# Altium schematic sheet MZ.SchDoc
size Letter; DocumentNumber: 4; SheetNumber: 4; SheetTotal: 8
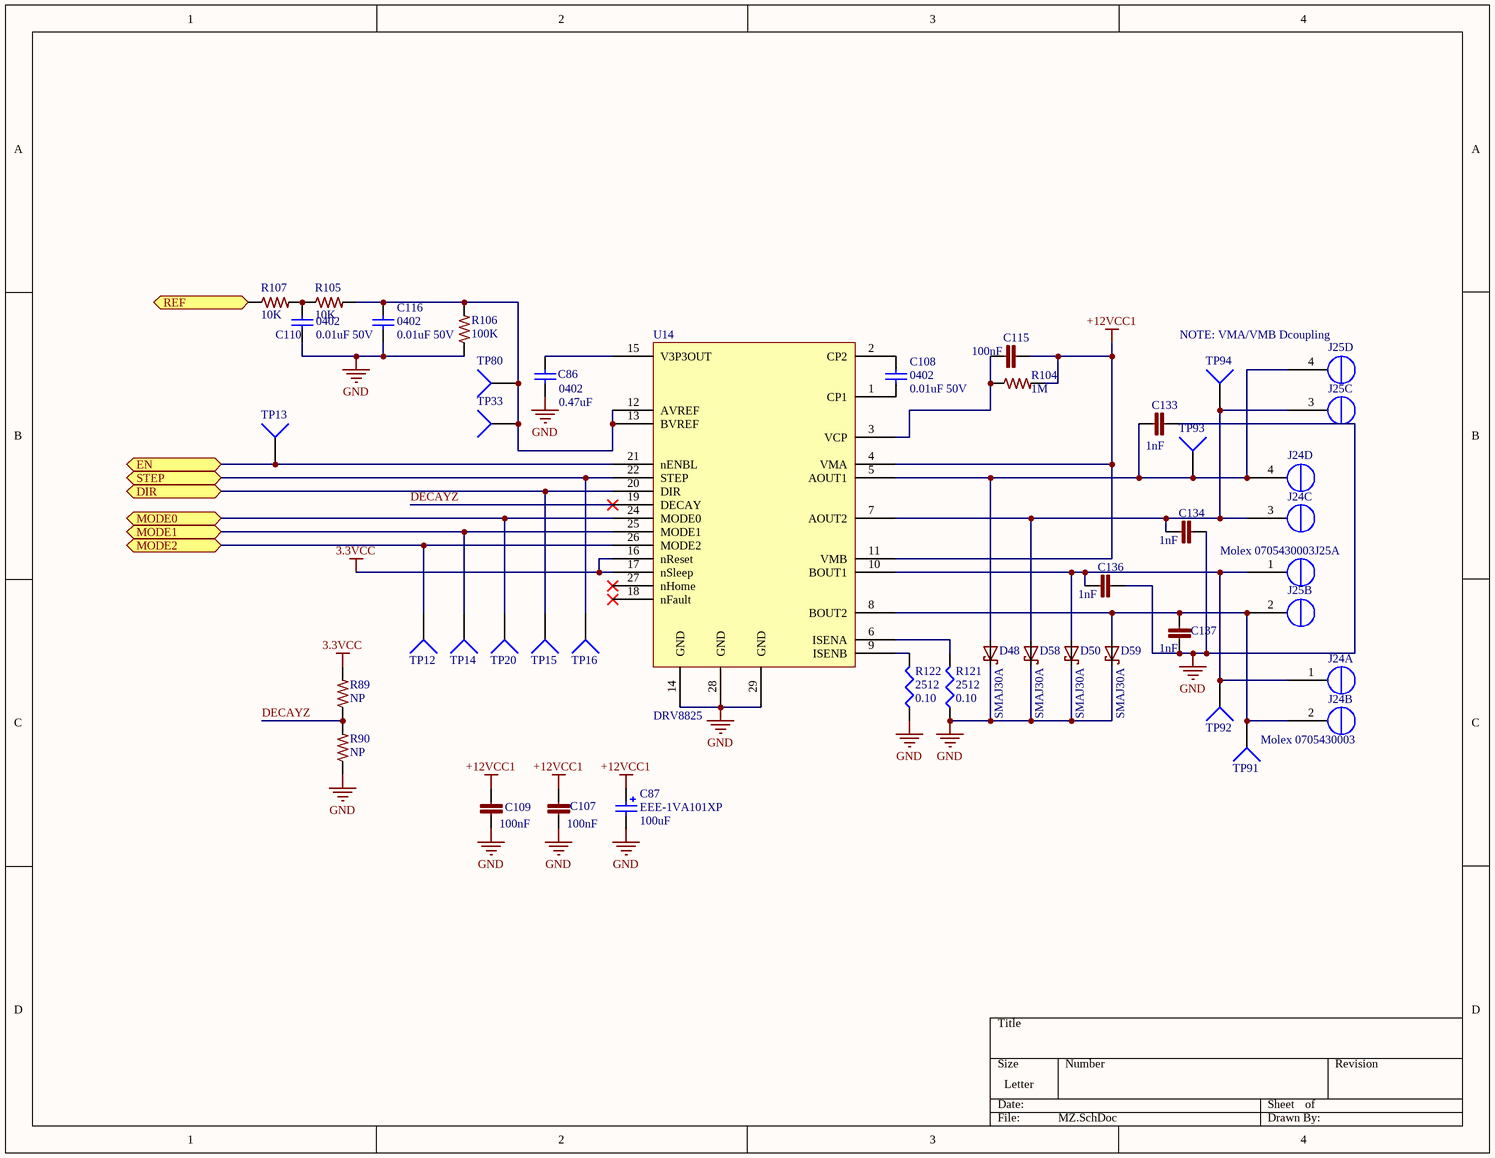
[diagram p0: MZ.SchDoc]

## Parts
C86  value 0.47uF  [C0402]  (hidden comment: 0402)
C87  EEE-1VA101XP  value 100uF  [EEE-1VA101XP]
C107  100nF  [C0603]
C108  value 0.01uF 50V  [C0402]  (hidden comment: 0402)
C109  100nF  [C0603]
C110  value 0.01uF 50V  [C0402]  (hidden comment: 0402)
C115  100nF  [C0402]
C116  value 0.01uF 50V  [C0402]  (hidden comment: 0402)
C133  1nF  [C0603]
C134  1nF  [C0603]
C136  1nF  [C0603]
C137  1nF  [C0603]
D48  SMAJ30A  [SMA-SM]
D50  SMAJ30A  [SMA-SM]
D58  SMAJ30A  [SMA-SM]
D59  SMAJ30A  [SMA-SM]
J24  Molex 0705430003  [4POL254]  (parts A,B,C,D of 4)
J25  Molex 0705430003  [4POL254]  (parts A,B,C,D of 4)
R89  NP  [R0402]
R90  NP  [R0402]
R104  1M  [R0402]
R105  10K  [R0402]
R106  100K  [R0402]
R107  10K  [R0402]
R121  2512  value 0.10  [2512R-0.55]
R122  2512  value 0.10  [2512R-0.55]
TP12  TP4  [TP-2]  (value not drawn)
TP13  TP4  [TP-2]  (value not drawn)
TP14  TP4  [TP-2]  (value not drawn)
TP15  TP4  [TP-2]  (value not drawn)
TP16  TP4  [TP-2]  (value not drawn)
TP20  TP4  [TP-2]  (value not drawn)
TP33  TP4  [TP-2]  (value not drawn)
TP80  TP4  [TP-2]  (value not drawn)
TP91  TP4  [TP-2]  (value not drawn)
TP92  TP4  [TP-2]  (value not drawn)
TP93  TP4  [TP-2]  (value not drawn)
TP94  TP4  [TP-2]  (value not drawn)
U14  DRV8825  [DRV8825PWPR]

## Ports
DIR, EN, MODE0, MODE1, MODE2, REF, STEP

## Nets
3.3VCC: R89.2 U14.16(nReset) U14.17(nSleep)
+12VCC1: C87.1 C107.1 C109.1 C115.2 R104.2 U14.4(VMA) U14.11(VMB)
GND: C86.1 C87.2 C107.2 C109.2 C110.1 C116.1 C133.2 C134.2 C136.2 C137.1 D48.C D50.C D58.C D59.C R90.1 R106.1 R121.1 R122.1 U14.14(GND) U14.28(GND) U14.29(GND)
DECAYZ: R89.1 R90.2 U14.19(DECAY)
DIR: TP15.1 U14.20(DIR) ; port DIR
EN: TP13.1 U14.21(nENBL) ; port EN
MODE0: TP20.1 U14.24(MODE0) ; port MODE0
MODE1: TP14.1 U14.25(MODE1) ; port MODE1
MODE2: TP12.1 U14.26(MODE2) ; port MODE2
REF: R107.1 ; port REF
STEP: TP16.1 U14.22(STEP) ; port STEP
NetC86_2: C86.2 U14.15(V3P3OUT)
NetC108_1: C108.1 U14.1(CP1)
NetC108_2: C108.2 U14.2(CP2)
NetC110_2: C110.2 R105.1 R107.2
NetC115_1: C115.1 R104.1 U14.3(VCP)
NetC116_2: C116.2 R105.2 R106.2 TP33.1 TP80.1 U14.12(AVREF) U14.13(BVREF)
NetC133_1: C133.1 D48.A J24.4(OUT1B) J25.4(OUT1B) TP93.1 U14.5(AOUT1)
NetC134_1: C134.1 D58.A J24.3(OUT1A) J25.3(OUT1A) TP94.1 U14.7(AOUT2)
NetC136_1: C136.1 D50.A J24.1(OUT2B) J25.1(OUT2B) TP92.1 U14.10(BOUT1)
NetC137_2: C137.2 D59.A J24.2(OUT2A) J25.2(OUT2A) TP91.1 U14.8(BOUT2)
NetR121_2: R121.2 U14.6(ISENA)
NetR122_2: R122.2 U14.9(ISENB)

Not connected (* = marked no-connect by the designer): U14 18(nFault)* 23(NC) 27(nHome)*

## Notes on the sheet
- NOTE: VMA/VMB Dcoupling

## Library data of the parts
C86 = GRM155R60J474KE19D: 0.47uF 6.3v C0402 - GRM155R60J474KE19D; MFR: Murata; Part Description: CAP CER 0.47UF 6.3V 10% X5R 0402; Tolerance: 10%; Voltage: 6.3VDC; Published: 10 - Dec - 2014; LatestRevisionDate: 10 - Dec - 2014; LatestRevisionNote: Ultimachine Footprint Added; Publisher: Ultimachine; Component Type: Chip Capacitor; MFR Part #: GRM155R60J474KE19D; Mounting Type: SMT 0402; Datasheet: http://search.murata.co.jp/Ceramy/image/img/A01X/G101/ENG/GRM155R60J474KE19-01.pdf; Height: 0.5 ±0.05mm; PackageReference: 0402
C87 = EEE-1VA101XP: CAP ALUM 100UF 35V 20% SMD; Manufacture: Panasonic; Digikey Part #: PCE3951CT-ND; Price: $0.63; Mount Type: SMT Panasonic VS D Series; Status: Active; Height: 7.70mm; Datasheet: http://industrial.panasonic.com/www-cgi/jvcr13pz.cgi?E+PZ+3+ABA0002+EEE1VA101XP+7+WW; Manufacture Part #: EEE-1VA101XP
C107 C109 = C0603C104K5RACTU: CAP CER 0603 100nF 50V 10% X7R; LastRevisionNote: ImportComponents; Published: 23-Apr-2014; Publisher: UltiMachine; LastRevisionDate: 23-Apr-2014; ManufacturerPartNumber: C0603C104K5RACTU; VALUE: 100nF
C108 C110 C116 = GRM155R71H103JA88D: CAP CER 10000PF 50V X7R 0402; MFR: Murata; Tolerance: 10%; Voltage: 6.3VDC; Published: 10 - Dec - 2014; LatestRevisionDate: 10 - Dec - 2014; LatestRevisionNote: Ultimachine Footprint Added; Publisher: Ultimachine; Component Type: Chip Capacitor; MFR Part #: GRM155R71H103JA88D; Part Description: CAP CER 10000PF 50V X7R 0402; Mounting Type: SMT 0402; Datasheet: http://search.murata.co.jp/Ceramy/image/img/A01X/G101/ENG/GRM155R71H103JA88-01.pdf; Height: 0.5 ±0.05mm; Digikey #: 490-7763-1-ND; PackageReference: 0402
C115 = GRM155R71C104KA88D: CAP CER 0402 100nF 16V 10% X7R; LastRevisionNote: ImportComponents; Published: 23-Apr-2014; Publisher: UltiMachine; LastRevisionDate: 23-Apr-2014; ManufacturerPartNumber: GRM155R71C104KA88D; VALUE: 100nF
C133 C134 C136 C137 = C0603C102K5RACTU: CAP CER 0603  1nF 50v 10% X7R; LastRevisionNote: ImportComponents; Published: 23-Apr-2014; Publisher: UltiMachine; LastRevisionDate: 23-Apr-2014; ManufacturerPartNumber: C0603C102K5RACTU; VALUE: 1nF
D48 D50 D58 D59 = SMAJ30A: DIODE TVS 30V SMA; LastRevisionNote: ImportComponents; Published: 23-Apr-2014; Publisher: UltiMachine; LastRevisionDate: 23-Apr-2014; ManufacturerPartNumber: SMAJ30A
J24 J25 = Molex 0705430003 Alt: Molex 4 Pin Clip Connector
R89 R90 = Resistor: LastRevisionNote: ImportComponents; Published: 23-Apr-2014; Publisher: UltiMachine; LastRevisionDate: 23-Apr-2014; VALUE: NP
R104 = ERJ2GEJ105X: RES 0402 1M 100mW 5%; LastRevisionNote: ImportComponents; Published: 23-Apr-2014; Publisher: UltiMachine; LastRevisionDate: 23-Apr-2014; ManufacturerPartNumber: ERJ2GEJ105X; VALUE: 1M
R105 R107 = RC0402FR-0710KP: RES SMD 10K OHM 1% 1/16W 0402; LastRevisionNote: ImportComponents; Published: 23-Apr-2014; Publisher: UltiMachine; LastRevisionDate: 23-Apr-2014; ManufacturerPartNumber: RC0402FR-0710KP; VALUE: 10K
R106 = RC1005F104CS: RES SMD 100K OHM 1% 1/16W 0402; Manufacturer: Samsung; LastRevisionNote: ImportComponents; Digilkey #: 1276-3432-1-ND; Published: 23-Apr-2014; Publisher: UltiMachine; LastRevisionDate: 23-Apr-2014; ManufacturerPartNumber: RC1005F104CS; VALUE: 100K
R121 R122 = CSRN2512FTR100: RES SMD 0.1 OHM 1% 2W 2512; MFR: Stackpole ELectronics Inc; PackageReference: 2512; MFR #: CSRN2512FTR100; Digikey #: CSRN2512FTR100TR-ND; PDF: http://www.seielect.com/catalog/SEI-CSR_CSRN.pdf
TP12-TP16 TP20 TP33 TP80 TP91-TP94 = Socket: LatestRevisionDate: 17-Jul-2002; LatestRevisionNote: Re-released for DXP Platform.; Publisher: Altium Limited
U14 = DRV8825: DRV8825 Ti Stepper Driver; Manufacture: Texas Instruments; Mountining Type: SMD - Ti PowerPAD Package; Voltage: 8.2-45VDC; Cost (1000 qty): 2.25; Part Number: DRV8825PWPR; Status: In-Production; Pins: 28 Pins and one Exposed Pad; Datasheet: http://www.ti.com/lit/gpn/drv8825; Height: 1.2mm; Tolerance: N/A; Type: Stepper Driver - Integrated Circuit; Lead Free: YES